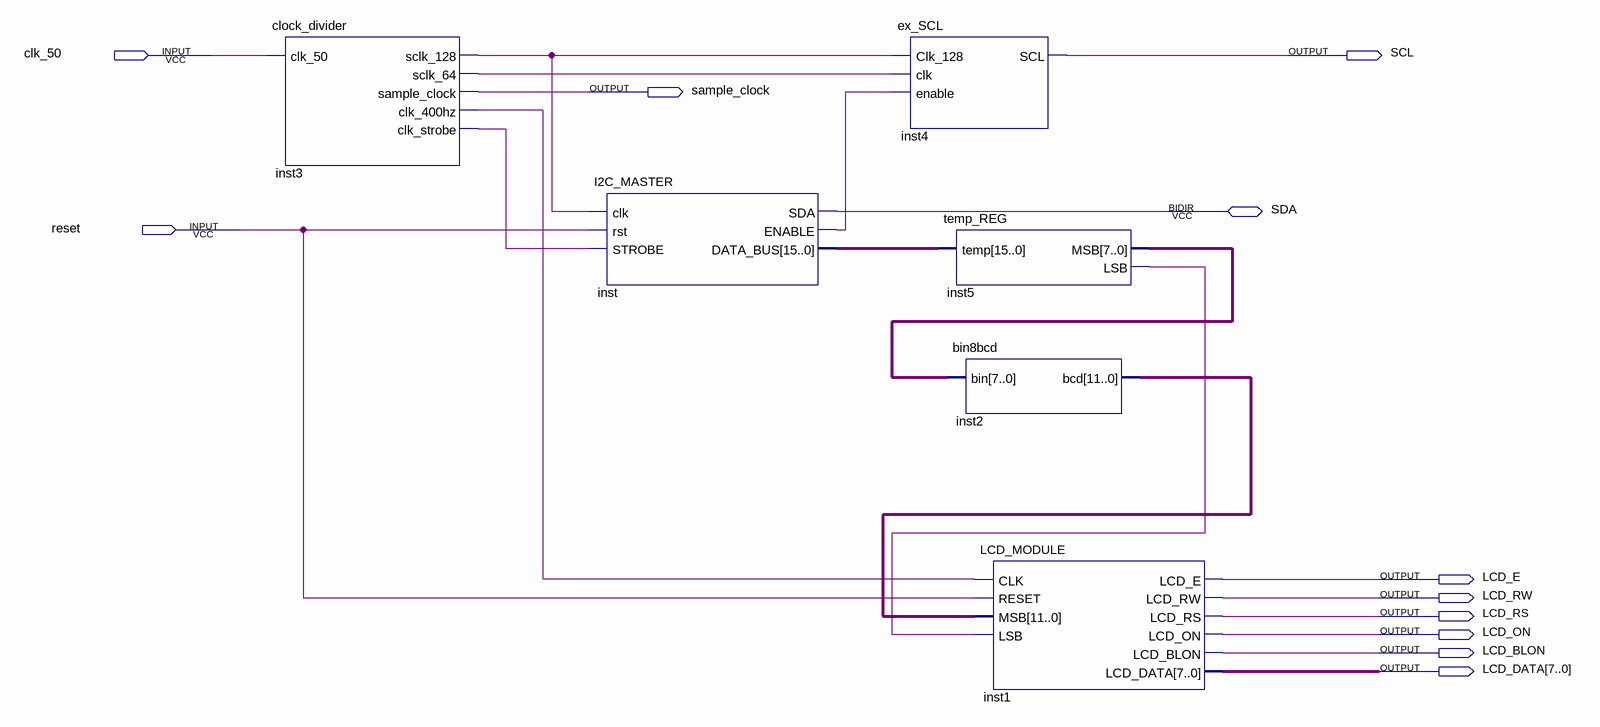
[diagram p0: schematic sheet]
// Quartus schematic TEMP_sen.bdf as structural Verilog: 6 symbols, 11 pins
module TEMP_sen (
  input  clk_50,
  input  reset,
  inout  SDA,
  output SCL,
  output sample_clock,
  output LCD_E,
  output LCD_RW,
  output LCD_RS,
  output LCD_ON,
  output LCD_BLON,
  output [7:0] LCD_DATA
);

  wire inst3_clk_400hz, inst3_clk_strobe, inst3_sclk_64, inst3_sclk_128, inst5_lsb, inst_enable;
  wire [7:0] inst5_msb;
  wire [11:0] inst2_bcd;
  wire [15:0] inst_data_bus;

  clock_divider inst3 (
    .clk_50(clk_50), .sclk_128(inst3_sclk_128), .sclk_64(inst3_sclk_64), .sample_clock(sample_clock),
    .clk_400hz(inst3_clk_400hz), .clk_strobe(inst3_clk_strobe));
  I2C_MASTER inst (
    .clk(inst3_sclk_128), .rst(reset), .STROBE(inst3_clk_strobe), .ENABLE(inst_enable),
    .DATA_BUS(inst_data_bus), .SDA(SDA));
  ex_SCL inst4 (.Clk_128(inst3_sclk_128), .clk(inst3_sclk_64), .enable(inst_enable), .SCL(SCL));
  temp_REG inst5 (.temp(inst_data_bus), .MSB(inst5_msb), .LSB(inst5_lsb));
  bin8bcd inst2 (.bin(inst5_msb), .bcd(inst2_bcd));
  LCD_MODULE inst1 (
    .CLK(inst3_clk_400hz), .RESET(reset), .MSB(inst2_bcd), .LSB(inst5_lsb), .LCD_E(LCD_E), .LCD_RW(LCD_RW),
    .LCD_RS(LCD_RS), .LCD_ON(LCD_ON), .LCD_BLON(LCD_BLON), .LCD_DATA(LCD_DATA));
endmodule
